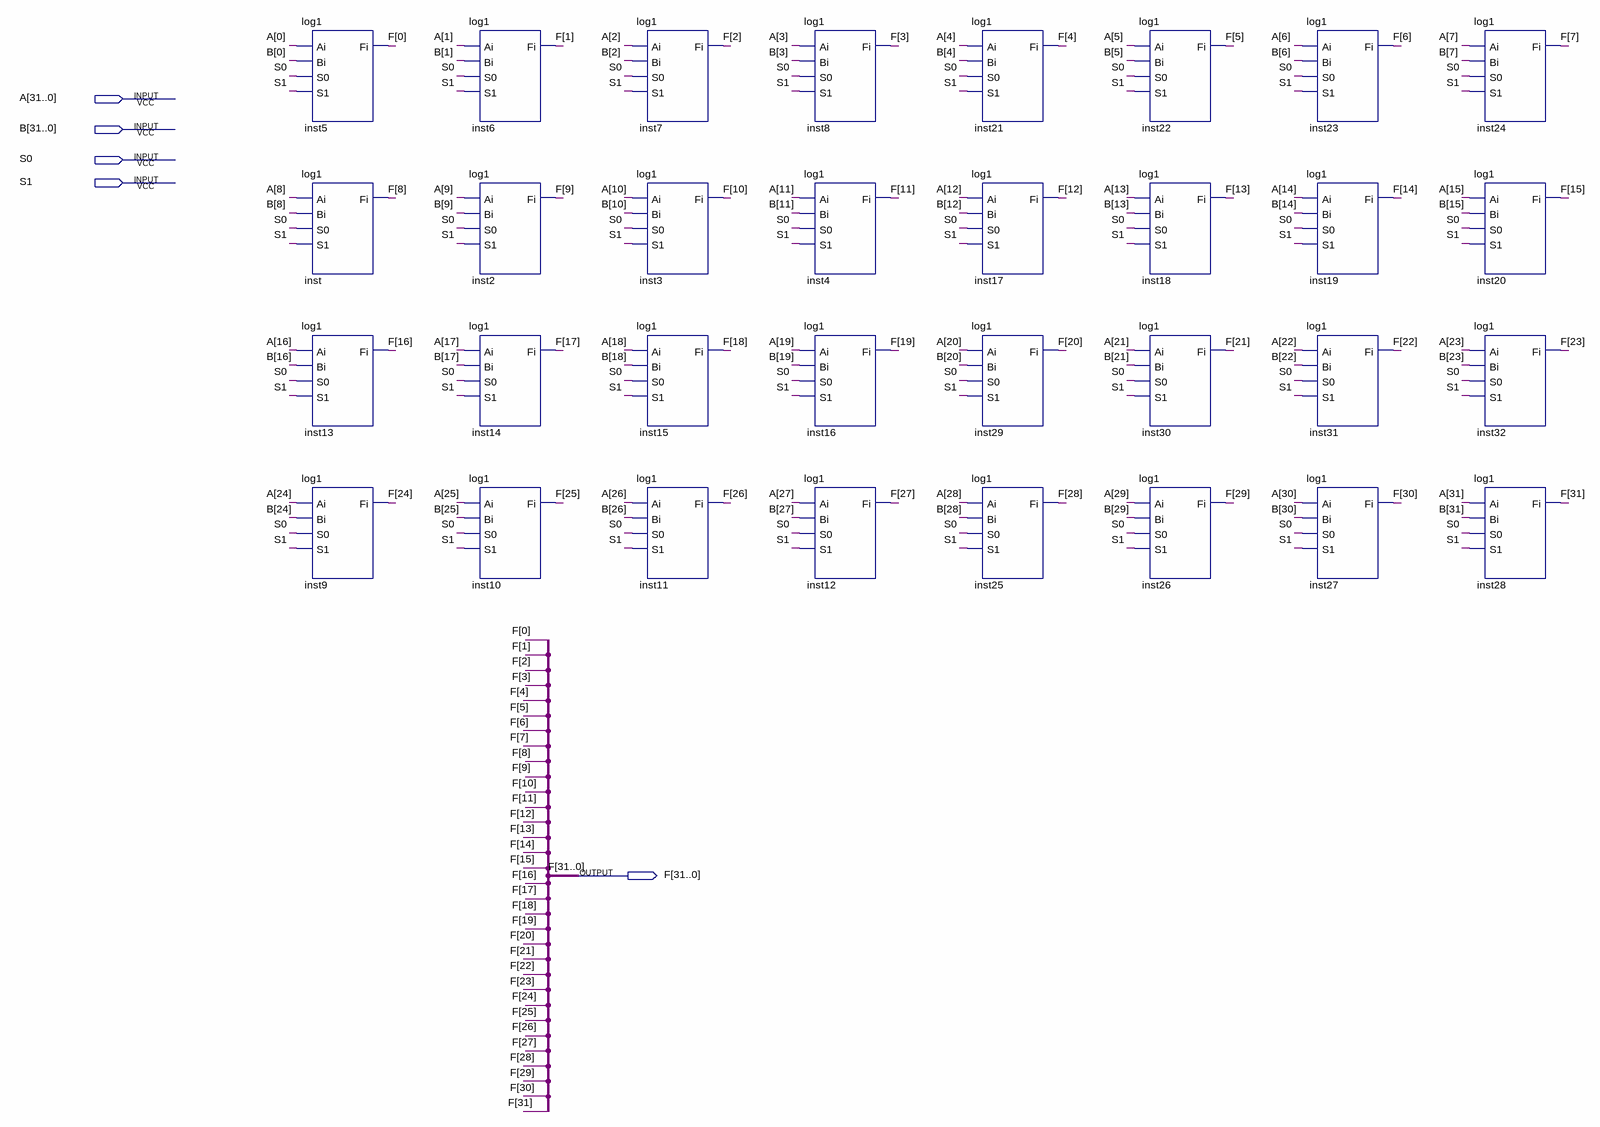
[diagram p0: schematic sheet]
// Quartus schematic log32.bdf as structural Verilog: 32 symbols, 5 pins
module log32 (
  input  [31:0] A,
  input  [31:0] B,
  input  S0,
  input  S1,
  output [31:0] F
);

  log1 inst5 (.Ai(A[0]), .Bi(B[0]), .S0(S0), .S1(S1), .Fi(F[0]));
  log1 inst (.Ai(A[8]), .Bi(B[8]), .S0(S0), .S1(S1), .Fi(F[8]));
  log1 inst13 (.Ai(A[16]), .Bi(B[16]), .S0(S0), .S1(S1), .Fi(F[16]));
  log1 inst9 (.Ai(A[24]), .Bi(B[24]), .S0(S0), .S1(S1), .Fi(F[24]));
  log1 inst6 (.Ai(A[1]), .Bi(B[1]), .S0(S0), .S1(S1), .Fi(F[1]));
  log1 inst2 (.Ai(A[9]), .Bi(B[9]), .S0(S0), .S1(S1), .Fi(F[9]));
  log1 inst14 (.Ai(A[17]), .Bi(B[17]), .S0(S0), .S1(S1), .Fi(F[17]));
  log1 inst10 (.Ai(A[25]), .Bi(B[25]), .S0(S0), .S1(S1), .Fi(F[25]));
  log1 inst7 (.Ai(A[2]), .Bi(B[2]), .S0(S0), .S1(S1), .Fi(F[2]));
  log1 inst3 (.Ai(A[10]), .Bi(B[10]), .S0(S0), .S1(S1), .Fi(F[10]));
  log1 inst15 (.Ai(A[18]), .Bi(B[18]), .S0(S0), .S1(S1), .Fi(F[18]));
  log1 inst11 (.Ai(A[26]), .Bi(B[26]), .S0(S0), .S1(S1), .Fi(F[26]));
  log1 inst8 (.Ai(A[3]), .Bi(B[3]), .S0(S0), .S1(S1), .Fi(F[3]));
  log1 inst4 (.Ai(A[11]), .Bi(B[11]), .S0(S0), .S1(S1), .Fi(F[11]));
  log1 inst16 (.Ai(A[19]), .Bi(B[19]), .S0(S0), .S1(S1), .Fi(F[19]));
  log1 inst12 (.Ai(A[27]), .Bi(B[27]), .S0(S0), .S1(S1), .Fi(F[27]));
  log1 inst21 (.Ai(A[4]), .Bi(B[4]), .S0(S0), .S1(S1), .Fi(F[4]));
  log1 inst17 (.Ai(A[12]), .Bi(B[12]), .S0(S0), .S1(S1), .Fi(F[12]));
  log1 inst29 (.Ai(A[20]), .Bi(B[20]), .S0(S0), .S1(S1), .Fi(F[20]));
  log1 inst25 (.Ai(A[28]), .Bi(B[28]), .S0(S0), .S1(S1), .Fi(F[28]));
  log1 inst22 (.Ai(A[5]), .Bi(B[5]), .S0(S0), .S1(S1), .Fi(F[5]));
  log1 inst18 (.Ai(A[13]), .Bi(B[13]), .S0(S0), .S1(S1), .Fi(F[13]));
  log1 inst30 (.Ai(A[21]), .Bi(B[21]), .S0(S0), .S1(S1), .Fi(F[21]));
  log1 inst26 (.Ai(A[29]), .Bi(B[29]), .S0(S0), .S1(S1), .Fi(F[29]));
  log1 inst23 (.Ai(A[6]), .Bi(B[6]), .S0(S0), .S1(S1), .Fi(F[6]));
  log1 inst19 (.Ai(A[14]), .Bi(B[14]), .S0(S0), .S1(S1), .Fi(F[14]));
  log1 inst31 (.Ai(A[22]), .Bi(B[22]), .S0(S0), .S1(S1), .Fi(F[22]));
  log1 inst27 (.Ai(A[30]), .Bi(B[30]), .S0(S0), .S1(S1), .Fi(F[30]));
  log1 inst24 (.Ai(A[7]), .Bi(B[7]), .S0(S0), .S1(S1), .Fi(F[7]));
  log1 inst20 (.Ai(A[15]), .Bi(B[15]), .S0(S0), .S1(S1), .Fi(F[15]));
  log1 inst32 (.Ai(A[23]), .Bi(B[23]), .S0(S0), .S1(S1), .Fi(F[23]));
  log1 inst28 (.Ai(A[31]), .Bi(B[31]), .S0(S0), .S1(S1), .Fi(F[31]));
endmodule
